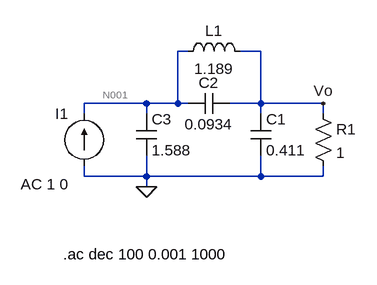
[diagram p0: schematic EJ2.asc]
EJ2.asc, the LTspice schematic file:
Version 4
SHEET 1 880 680
WIRE 96 0 80 0
WIRE 208 0 176 0
WIRE 32 80 -64 80
WIRE 80 80 80 0
WIRE 80 80 32 80
WIRE 96 80 80 80
WIRE 208 80 208 0
WIRE 208 80 160 80
WIRE 304 80 208 80
WIRE -64 96 -64 80
WIRE 32 96 32 80
WIRE 208 96 208 80
WIRE 304 96 304 80
WIRE -64 192 -64 176
WIRE 32 192 32 160
WIRE 32 192 -64 192
WIRE 208 192 208 160
WIRE 208 192 32 192
WIRE 304 192 304 176
WIRE 304 192 208 192
WIRE 32 208 32 192
FLAG 32 208 0
FLAG 304 80 Vo
SYMBOL current -64 176 R180
WINDOW 0 24 80 Left 2
WINDOW 3 24 0 Left 2
WINDOW 123 24 -28 Left 2
WINDOW 39 0 0 Left 0
SYMATTR InstName I1
SYMATTR Value ""
SYMATTR Value2 AC 1 0
SYMBOL cap 192 96 R0
SYMATTR InstName C1
SYMATTR Value 0.411
SYMBOL cap 160 64 R90
WINDOW 0 0 32 VBottom 2
WINDOW 3 32 32 VTop 2
SYMATTR InstName C2
SYMATTR Value 0.0934
SYMBOL ind 80 16 R270
WINDOW 0 32 56 VTop 2
WINDOW 3 5 56 VBottom 2
SYMATTR InstName L1
SYMATTR Value 1.189
SYMBOL cap 16 96 R0
SYMATTR InstName C3
SYMATTR Value 1.588
SYMBOL res 288 80 R0
SYMATTR InstName R1
SYMATTR Value 1
TEXT -96 312 Left 2 !.ac dec 100 0.001 1000

The netlist it stands for:
* EJ2.asc
I1 0 N001 AC 1 0
C1 Vo 0 0.411
C2 Vo N001 0.0934
L1 N001 Vo 1.189
C3 N001 0 1.588
R1 Vo 0 1
.ac dec 100 0.001 1000
.backanno
.end

* Results of the author's LTspice run, read from the files saved beside the schematic
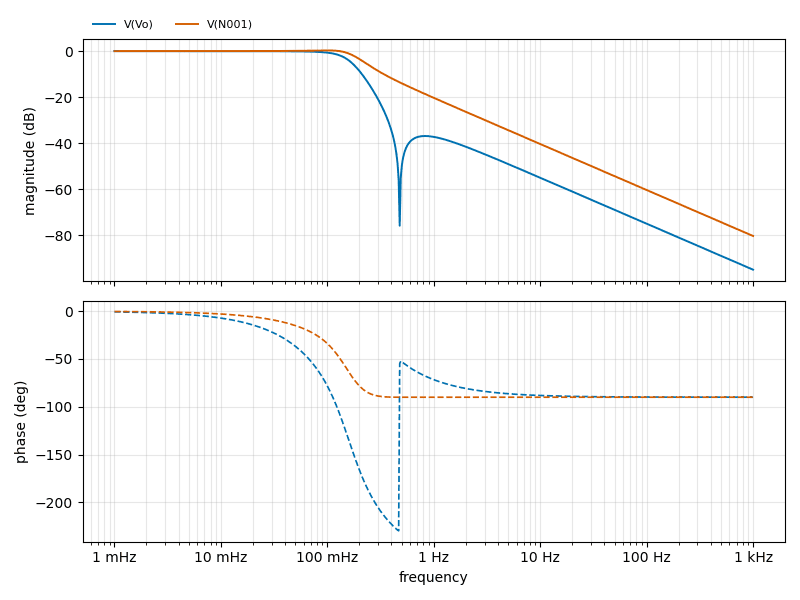
[diagram p1: AC Analysis of EJ2.asc, plotted from the saved traces]
* AC Analysis, 1 run:
*   V(Vo): -0.00 dB at 1 mHz, -95.04 dB at 1 kHz, peak -0.00 dB at 1 mHz, 3 dB below the peak at 147.4 mHz
*   V(N001): 0.01 dB at 1 mHz, -80.39 dB at 1 kHz, peak 0.31 dB at 100 mHz, 3 dB below the peak at 188 mHz